# EAGLE design mLRS-tx-dualSx-top-v031 (EAGLE 7.5.0)
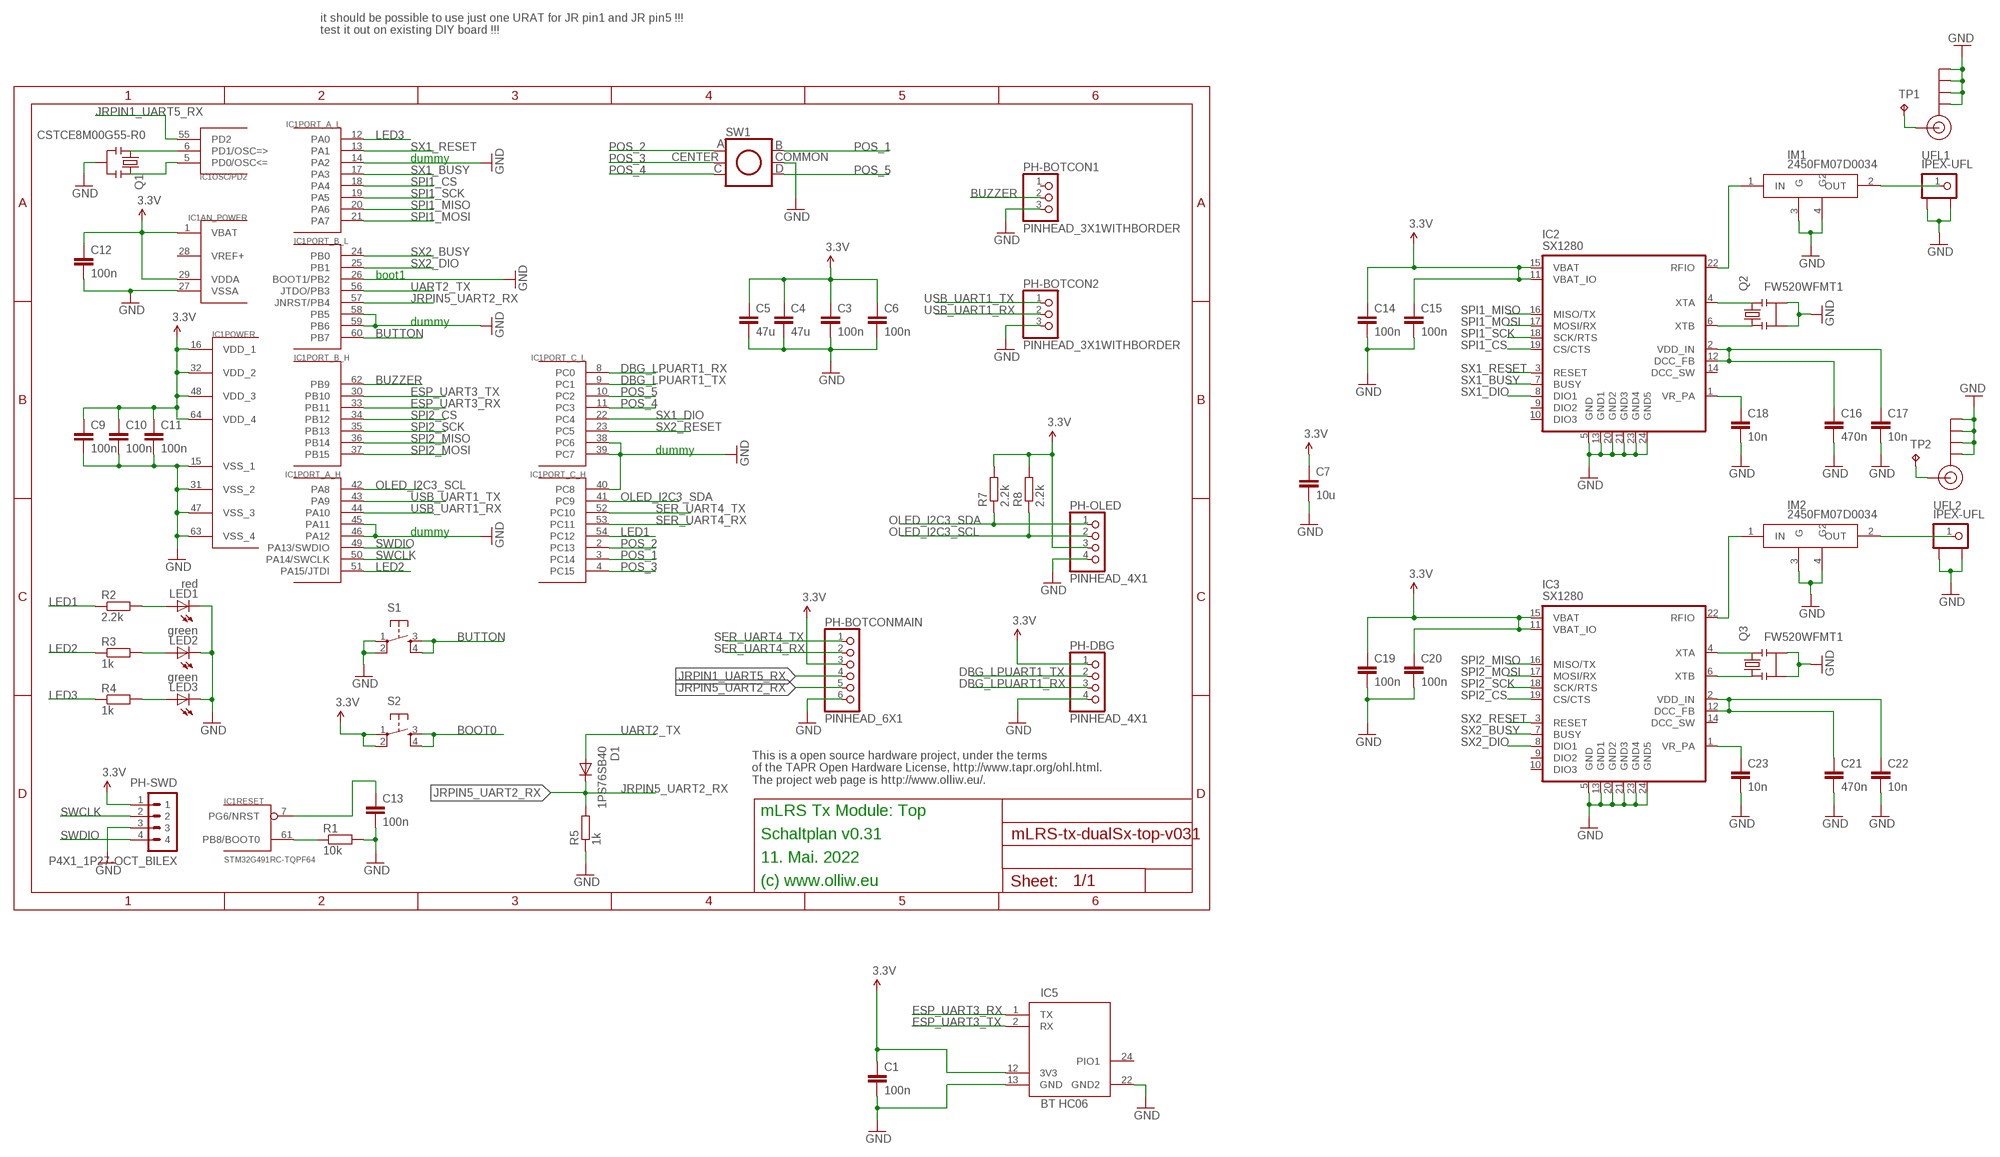
[diagram p0: schematic, sheet 1]

## Parts
C1  100n  C-EUC0603  [C0603]
C3  100n  C-EUC0402  [C0402]
C4  47u  C-EUC1210  [C1210]
C5  47u  C-EUC1206K  [C1206K]
C6  100n  C-EUC0402  [C0402]
C7  10u  C-EUC0603  [C0603]
C9  100n  C-EUC0402  [C0402]
C10  100n  C-EUC0402  [C0402]
C11  100n  C-EUC0402  [C0402]
C12  100n  C-EUC0402  [C0402]
C13  100n  C-EUC0402  [C0402]
C14  100n  C-EUC0402  [C0402]
C15  100n  C-EUC0402  [C0402]
C16  470n  C-EUC0402  [C0402]
C17  10n  C-EUC0402  [C0402]
C18  10n  C-EUC0402  [C0402]
C19  100n  C-EUC0402  [C0402]
C20  100n  C-EUC0402  [C0402]
C21  470n  C-EUC0402  [C0402]
C22  10n  C-EUC0402  [C0402]
C23  10n  C-EUC0402  [C0402]
D1  1PS76SB40  DIODE-SOD110-R  [SOD110-R]
IC1  STM32G491RC-TQPF64  STM32G4X1RX-TQPF64  [TQFP64]
IC2  SX1280  [QFN24-4X4-SX128X]
IC3  SX1280  [QFN24-4X4-SX128X]
IC5  BT HC06  HC06-BASIC  [BT_HC05_BASIC]
IM1  2450FM07D0034  SX-IMPEDANCE-MATCH  [SX-IMPEDANCE-MATCH]
IM2  2450FM07D0034  SX-IMPEDANCE-MATCH  [SX-IMPEDANCE-MATCH]
LED1  red  LEDCHIPLED_0603  [CHIPLED_0603]
LED2  green  LEDCHIPLED_0603  [CHIPLED_0603]
LED3  green  LEDCHIPLED_0603  [CHIPLED_0603]
PH-BOTCON1  PINHEAD_3X1WITHBORDER  [PINHEAD_3X1]
PH-BOTCON2  PINHEAD_3X1WITHBORDER  [PINHEAD_3X1]
PH-BOTCONMAIN  PINHEAD_6X1  [PINHEAD_6X1]
PH-DBG  PINHEAD_4X1  [PINHEAD_4X1]
PH-OLED  PINHEAD_4X1  [PINHEAD_4X1]
PH-SWD  P4X1_1P27-OCT_BILEX  [4X1_1P27_OCT_BILEX]
Q1  CSTCE8M00G55-R0  RESONATORSMD  [RESONATOR-SMD]
Q2  FW520WFMT1  CRYSTAL52MHZ  [CRYSTAL-SMD-2X1P6-GND]
Q3  FW520WFMT1  CRYSTAL52MHZ  [CRYSTAL-SMD-2X1P6-GND]
R1  10k  R-EU_R0402  [R0402]
R2  2.2k  R-EU_R0402  [R0402]
R3  1k  R-EU_R0402  [R0402]
R4  1k  R-EU_R0402  [R0402]
R5  1k  R-EU_R0402  [R0402]
R7  2.2k  R-EU_R0402  [R0402]
R8  2.2k  R-EU_R0402  [R0402]
RF1  SMA_EDGE  [SMA-EDGE]
RF2  SMA_EDGE  [SMA-EDGE]
S1  TAC_SWITCHPTH  [TACTILE-PTH]
S2  TAC_SWITCHPTH  [TACTILE-PTH]
SW1  JOYSTICK-5WAY  [JOYSTICK-5WAY]
TP1  TPTP10SQ  [TP10SQ]
TP2  TPTP10SQ  [TP10SQ]
UFL1  IPEX-UFL  [IPEX-UFL-SMD]
UFL2  IPEX-UFL  [IPEX-UFL-SMD]

## Nets
3.3V: C1.1 C3.1 C4.1 C5.1 C6.1 C7.1 C9.1 C10.1 C11.1 C12.1 C14.1 C15.1 C19.1 C20.1 IC1.1(AN_POWER:VBAT) IC1.16(POWER:VDD_1) IC1.29(AN_POWER:VDDA) IC1.32(POWER:VDD_2) IC1.48(POWER:VDD_3) IC1.64(POWER:VDD_4) IC2.11(VBAT_IO) IC2.15(VBAT) IC3.11(VBAT_IO) IC3.15(VBAT) IC5.12(3V3) PH-BOTCONMAIN.3 PH-DBG.1 PH-OLED.3 PH-SWD.1 R7.2 R8.2 S2.1 S2.2
BOOT0: IC1.61(RESET:PB8/BOOT0) R1.1 S2.3 S2.4
BUTTON: IC1.60(PORT_B_L:PB7) S1.3 S1.4
BUZZER: IC1.62(PORT_B_H:PB9) PH-BOTCON1.2
DBG_LPUART1_RX: IC1.8(PORT_C_L:PC0) PH-DBG.3
DBG_LPUART1_TX: IC1.9(PORT_C_L:PC1) PH-DBG.2
ESP_UART3_RX: IC1.33(PORT_B_H:PB11) IC5.1(TX)
ESP_UART3_TX: IC1.30(PORT_B_H:PB10) IC5.2(RX)
GND: C1.2 C3.2 C4.2 C5.2 C6.2 C7.2 C9.2 C10.2 C11.2 C12.2 C13.2 C14.2 C15.2 C16.2 C17.2 C18.2 C19.2 C20.2 C21.2 C22.2 C23.2 IC1.14(PORT_A_L:PA2) IC1.15(POWER:VSS_1) IC1.26(PORT_B_L:BOOT1/PB2) IC1.27(AN_POWER:VSSA) IC1.31(POWER:VSS_2) IC1.38(PORT_C_L:PC6) IC1.39(PORT_C_L:PC7) IC1.40(PORT_C_H:PC8) IC1.45(PORT_A_H:PA11) IC1.46(PORT_A_H:PA12) IC1.47(POWER:VSS_3) IC1.58(PORT_B_L:PB5) IC1.59(PORT_B_L:PB6) IC1.63(POWER:VSS_4) IC2.5(GND) IC2.13(GND1) IC2.20(GND2) IC2.21(GND3) IC2.23(GND4) IC2.24(GND5) IC3.5(GND) IC3.13(GND1) IC3.20(GND2) IC3.21(GND3) IC3.23(GND4) IC3.24(GND5) IC5.13(GND) IC5.22(GND2) IM1.3(G) IM1.4(G2) IM2.3(G) IM2.4(G2) LED1.C LED2.C LED3.C PH-BOTCON1.3 PH-BOTCON2.3 PH-BOTCONMAIN.6 PH-DBG.4 PH-OLED.4 PH-SWD.3 Q1.2 Q2.2 Q2.4 Q3.2 Q3.4 R1.2 R5.1 RF1.GND@0(GND) RF1.GND@1(GND) RF1.GND@2(GND) RF1.GND@3(GND) RF2.GND@0(GND) RF2.GND@1(GND) RF2.GND@2(GND) RF2.GND@3(GND) S1.1 S1.2 SW1.5(COMMON) UFL1.2 UFL1.3 UFL2.2 UFL2.3
JRPIN1_UART5_RX: IC1.55(OSC/PD2:PD2) PH-BOTCONMAIN.4
JRPIN5_UART2_RX: D1.C IC1.57(PORT_B_L:JNRST/PB4) PH-BOTCONMAIN.5 R5.2
LED1: IC1.54(PORT_C_H:PC12) R2.1
LED2: IC1.51(PORT_A_H:PA15/JTDI) R3.1
LED3: IC1.12(PORT_A_L:PA0) R4.1
N$1: RF2.SIG(SIGNAL) TP1.TP
N$2: C21.1 C22.1 IC3.2(VDD_IN) IC3.12(DCC_FB)
N$3: RF1.SIG(SIGNAL) TP2.TP
N$4: LED1.A R2.2
N$5: C13.1 IC1.7(RESET:PG6/NRST)
N$6: C23.1 IC3.1(VR_PA)
N$7: IC3.4(XTA) Q3.3
N$8: LED2.A R3.2
N$9: LED3.A R4.2
N$10: IC3.6(XTB) Q3.1
N$11: IC3.22(RFIO) IM2.1(IN)
N$12: IC1.5(OSC/PD2:PD0/OSC<=) Q1.3
N$13: C16.1 C17.1 IC2.2(VDD_IN) IC2.12(DCC_FB)
N$14: IC1.6(OSC/PD2:PD1/OSC=>) Q1.1
N$15: C18.1 IC2.1(VR_PA)
N$16: IC2.4(XTA) Q2.3
N$17: IC2.6(XTB) Q2.1
N$18: IC2.22(RFIO) IM1.1(IN)
N$19: IM1.2(OUT) UFL1.1
N$20: IM2.2(OUT) UFL2.1
OLED_I2C3_SCL: IC1.42(PORT_A_H:PA8) PH-OLED.2 R8.1
OLED_I2C3_SDA: IC1.41(PORT_C_H:PC9) PH-OLED.1 R7.1
POS_1: IC1.3(PORT_C_H:PC14) SW1.4(B)
POS_2: IC1.2(PORT_C_H:PC13) SW1.1(A)
POS_3: IC1.4(PORT_C_H:PC15) SW1.2(CENTER)
POS_4: IC1.11(PORT_C_L:PC3) SW1.3(C)
POS_5: IC1.10(PORT_C_L:PC2) SW1.6(D)
SER_UART4_RX: IC1.53(PORT_C_H:PC11) PH-BOTCONMAIN.2
SER_UART4_TX: IC1.52(PORT_C_H:PC10) PH-BOTCONMAIN.1
SPI1_CS: IC1.18(PORT_A_L:PA4) IC2.19(CS/CTS)
SPI1_MISO: IC1.20(PORT_A_L:PA6) IC2.16(MISO/TX)
SPI1_MOSI: IC1.21(PORT_A_L:PA7) IC2.17(MOSI/RX)
SPI1_SCK: IC1.19(PORT_A_L:PA5) IC2.18(SCK/RTS)
SPI2_CS: IC1.34(PORT_B_H:PB12) IC3.19(CS/CTS)
SPI2_MISO: IC1.36(PORT_B_H:PB14) IC3.16(MISO/TX)
SPI2_MOSI: IC1.37(PORT_B_H:PB15) IC3.17(MOSI/RX)
SPI2_SCK: IC1.35(PORT_B_H:PB13) IC3.18(SCK/RTS)
SWCLK: IC1.50(PORT_A_H:PA14/SWCLK) PH-SWD.2
SWDIO: IC1.49(PORT_A_H:PA13/SWDIO) PH-SWD.4
SX1_BUSY: IC1.17(PORT_A_L:PA3) IC2.7(BUSY)
SX1_DIO: IC1.22(PORT_C_L:PC4) IC2.8(DIO1)
SX1_RESET: IC1.13(PORT_A_L:PA1) IC2.3(RESET)
SX2_BUSY: IC1.24(PORT_B_L:PB0) IC3.7(BUSY)
SX2_DIO: IC1.25(PORT_B_L:PB1) IC3.8(DIO1)
SX2_RESET: IC1.23(PORT_C_L:PC5) IC3.3(RESET)
UART2_TX: D1.A IC1.56(PORT_B_L:JTDO/PB3)
USB_UART1_RX: IC1.44(PORT_A_H:PA10) PH-BOTCON2.2
USB_UART1_TX: IC1.43(PORT_A_H:PA9) PH-BOTCON2.1
Unconnected: IC1.28(AN_POWER:VREF+) IC2.9(DIO2) IC2.10(DIO3) IC2.14(DCC_SW) IC3.9(DIO2) IC3.10(DIO3) IC3.14(DCC_SW) IC5.24(PIO1) PH-BOTCON1.1

## Notes on the sheet
- it should be possible to use just one URAT for JR pin1 and JR pin5 !!!
  test it out on existing DIY board !!!
- dummy
- boot1
- dummy
- dummy
- dummy
- This is a open source hardware project, under the terms
  of the TAPR Open Hardware License, http://www.tapr.org/ohl.html.
  The project web page is http://www.olliw.eu/.
- mLRS Tx Module: Top
- Schaltplan v0.31
- 11. Mai. 2022
- (c) www.olliw.eu

## Library data of the parts
C1 C3-C7 C9-C23 = rcl:C-EU: CAPACITOR, European symbol
D1 = diode:DIODE-: DIODE
IC1 = # stm32:STM32G4X1RX
IC2 IC3 = # stdlib:SX1280
IC5 = # SerialPortBluetooth:HC06-BASIC
IM1 IM2 = # stdlib:SX-IMPEDANCE-MATCH
LED1-LED3 = led:LED: LED OSRAM: - CHIPLED LG R971, LG N971, LY N971, LG Q971, LY Q971, LO R971, LY R971 LH N974, LH R974 LS Q976, LO Q976, LY Q976 LO Q996 - Hyper CHIPLED LW Q18S LB Q993, LB Q99A, LB R99A - SideLED LS A670, LO A670, LY A670, LG A670, LP A670 LB A673, LV A673, LT A673, LW A673 LH A674 LY A675 LS A676, LA A676, LO A676, LY A676, LW A676 LS A679, LY A679, LG A679 - Hyper Micro SIDELED® LS Y876, LA Y876, LO Y876, LY Y876 LT Y87S - SmartLED LW L88C, LW L88S LB L89C, LB L89S, LG L890 LS L89K, LO L89K, LY L89K LS L896, LA L896, LO L896, LY L896 - TOPLED LS T670, LO T670, LY T670, LG T670, LP T670 LSG T670, LSP T670, LSY T670, LOP T670, LYG T670 LG T671, LOG T671, LSG T671 LB T673, LV T673, LT T673, LW T673 LH T674 LS T676, LA T676, LO T676, LY T676, LB T676, LH T676, LSB T676, LW T676 LB T67C, LV T67C, LT T67C, LS T67K, LO T67K, LY T67K, LW E67C LS E67B, LA E67B, LO E67B, LY E67B, LB E67C, LV E67C, LT E67C LW T67C LS T679, LY T679, LG T679 LS T770, LO T770, LY T770, LG T770, LP T770 LB T773, LV T773, LT T773, LW T773 LH T774 LS E675, LA E675, LY E675, LS T675 LS T776, LA T776, LO T776, LY T776, LB T776 LHGB T686 LT T68C, LB T68C - Hyper Mini TOPLED® LB M676 - Mini TOPLED Santana® LG M470 LS M47K, LO M47K, LY M47K Source: http://www.osram.convergy.de LUXEON: - LUMILED® LXK2-PW12-R00, LXK2-PW12-S00, LXK2-PW14-U00, LXK2-PW14-V00 LXK2-PM12-R00, LXK2-PM12-S00, LXK2-PM14-U00 LXK2-PE12-Q00, LXK2-PE12-R00, LXK2-PE12-S00, LXK2-PE14-T00, LXK2-PE14-U00 LXK2-PB12-K00, LXK2-PB12-L00, LXK2-PB12-M00, LXK2-PB14-N00, LXK2-PB14-P00, LXK2-PB14-Q00 LXK2-PR12-L00, LXK2-PR12-M00, LXK2-PR14-Q00, LXK2-PR14-R00 LXK2-PD12-Q00, LXK2-PD12-R00, LXK2-PD12-S00 LXK2-PH12-R00, LXK2-PH12-S00 LXK2-PL12-P00, LXK2-PL12-Q00, LXK2-PL12-R00 Source: www.luxeon.com KINGBRIGHT: KA-3528ASYC Source: www.kingbright.com
PH-BOTCON1 PH-BOTCON2 = # stdlib:PINHEAD_3X1
PH-BOTCONMAIN = # stdlib:PINHEAD_6X1
PH-DBG PH-OLED = # stdlib:PINHEAD_4X1
PH-SWD = # stdlib:P4X1_1P27
Q1 = # SparkFun2:RESONATOR: Resonator Small SMD resonator. This is the itty bitty 10/20MHz resonators with built in caps. CSTCE10M0G55 and CSTCE20M0V53. Footprint has been reviewed closely but hasn't been tested yet.
Q2 Q3 = # stdlib:CRYSTAL52MHZ
R1-R5 R7 R8 = rcl:R-EU_: RESISTOR, European symbol
RF1 RF2 = # SparkFun2:SMA_EDGE: SMA Antenna Connector End launch SMA connector. The paste layer has been removed so that the connector can be hand soldered onto the board after reflow.
S1 S2 = # SparkFun2:TAC_SWITCH: Momentary Switch Button commonly used for reset or general input. Spark Fun Electronics SKU : COM-00097
SW1 = # stdlib:JOYSTICK-5WAY
TP1 TP2 = testpad:TP: Test pad
UFL1 UFL2 = # stdlib:IPEX-UFL

## Board
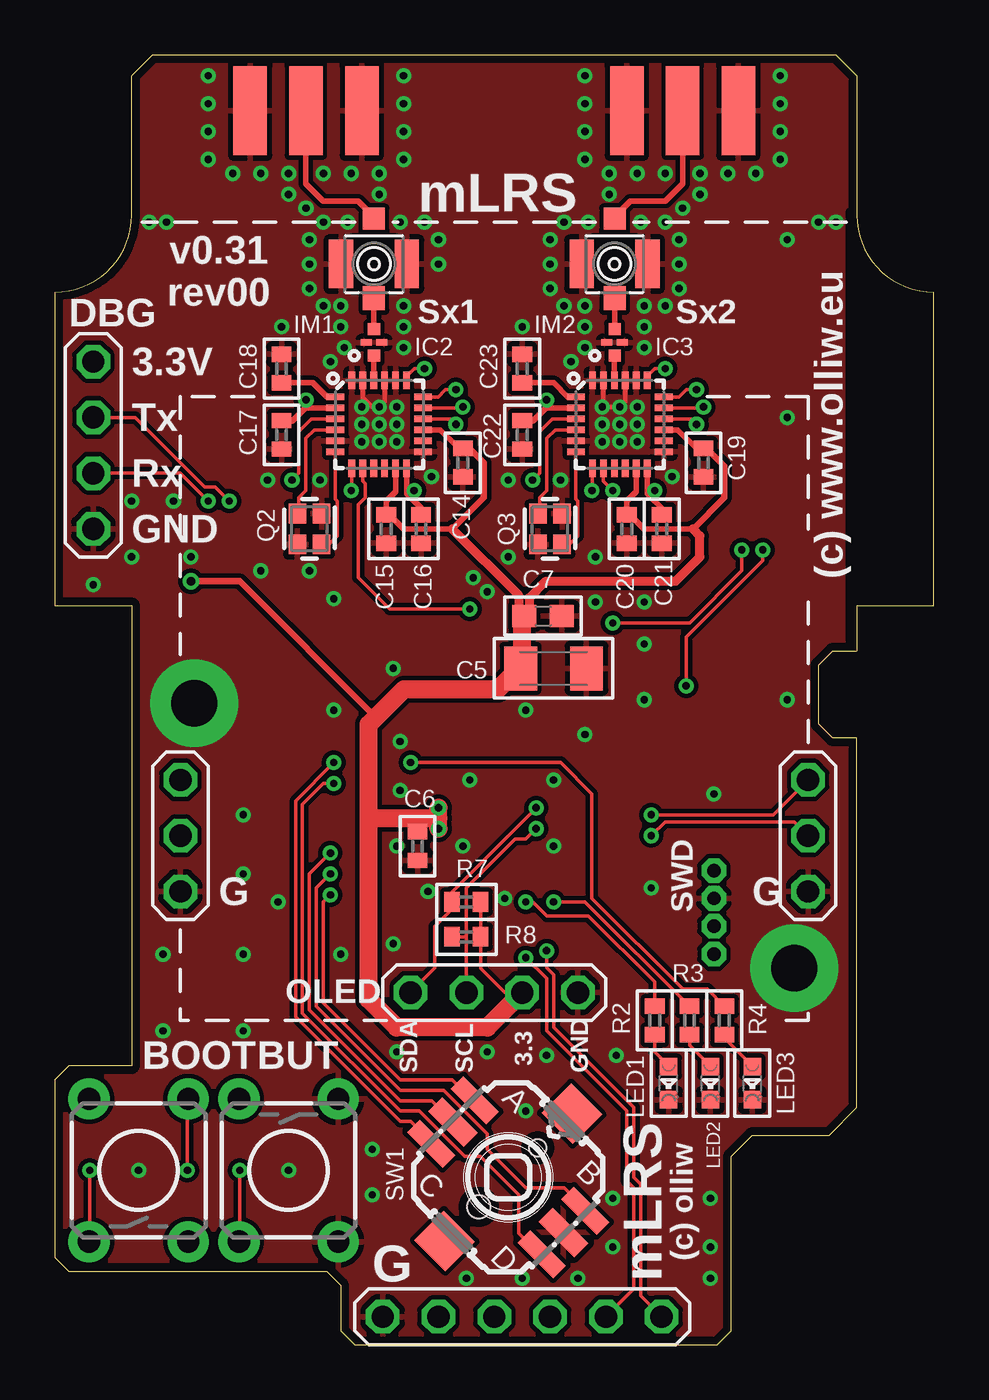
[diagram p1: board, top side]
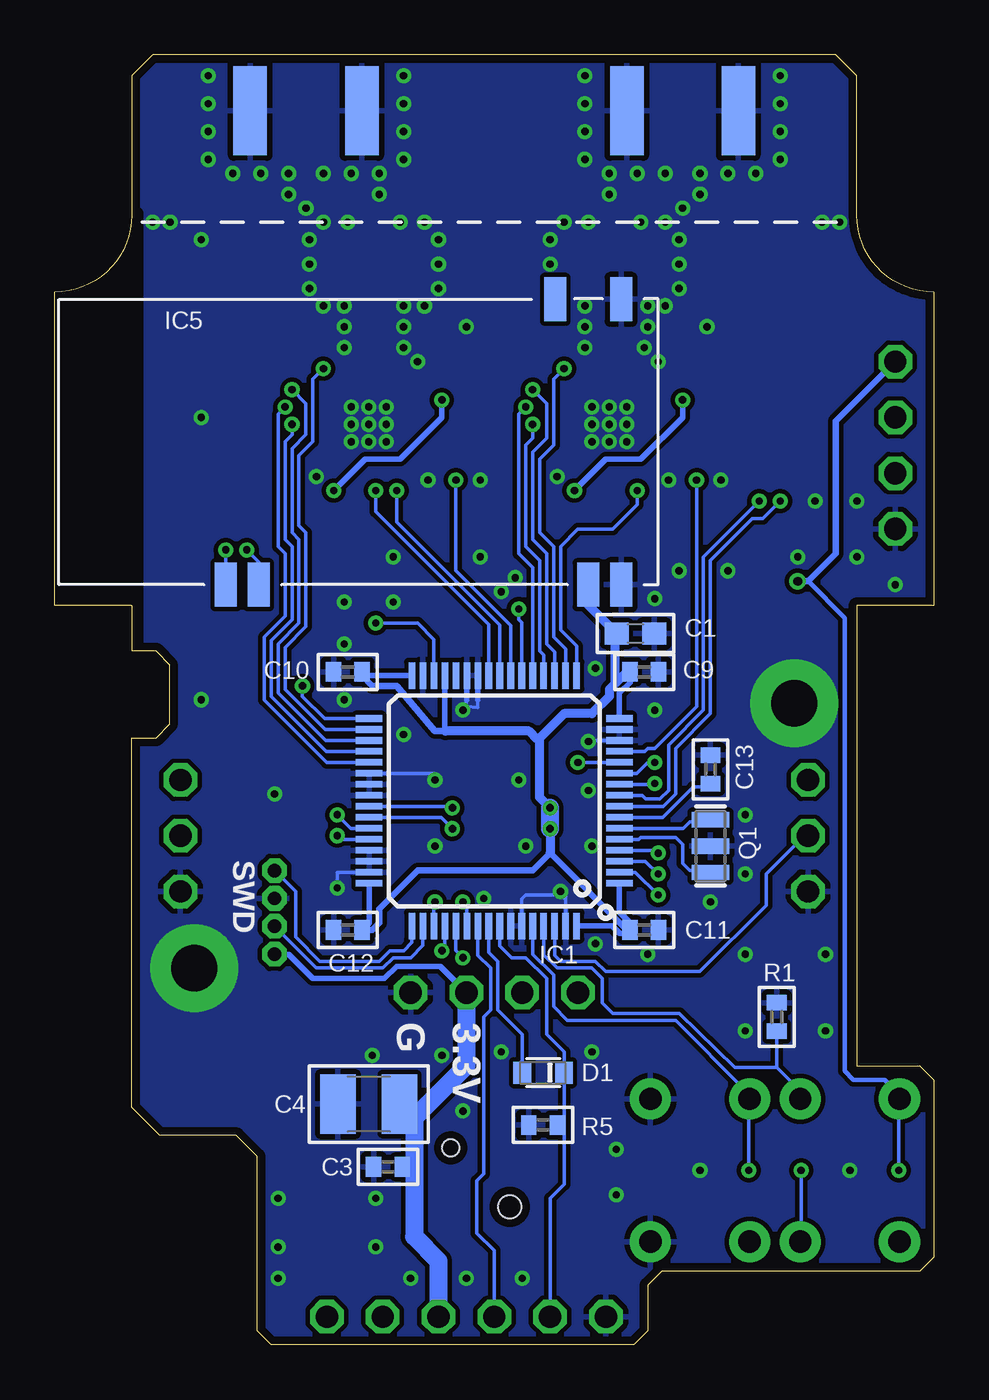
[diagram p2: board, bottom side, seen from below]

Size 40.01 x 58.74 mm. Coordinates in mm from the lower left corner, seen from the top.
Outline: 36.51,10.79 36.51,27.62 35.4,27.62 34.77,28.26 34.77,30.96 35.4,31.59 36.51,31.59 36.51,33.66 40.01,33.66 40.01,47.94 arc-90 36.51,51.44 36.51,57.78 35.56,58.74 4.45,58.74 3.49,57.78 3.49,51.44 arc-90 0,47.94 0,33.66 3.49,33.66 3.49,12.7 0.64,12.7 0,12.07 0,3.97 0.64,3.33 12.38,3.33 13.02,2.7 13.02,0.63 13.65,0 30.16,0 30.8,0.63 30.8,8.57 31.75,9.53 35.24,9.53 36.51,10.79
Copper layers (1*16): Top 0.0356mm / dielectric 1.5011mm / Bottom 0.0356mm
Design rules "ow-oshpark-2layer": minimum track width 6mil, minimum drill 13mil, track to track 6mil, track to pad 6mil, pad to pad 6mil, via to via 6mil, smd to smd 6mil, copper to edge 15mil, drill to drill 6mil, minimum pad ring 7mil, minimum via ring 7mil, stop-mask expansion 2.5mil, vias tented up to drill 26mil, thermal gap 10mil
tRestrict: area 36.2,31.1 to 40.2,51.6
bRestrict: area 36.2,31.1 to 40.2,51.6

### Footprints (pad centres in the part's own frame; a part is rotated, then mirrored left to right if it is on the bottom)
C0603 = smd 1.1 x 1: 1 -0.85,0; 2 0.85,0
C0402 = smd 0.7 x 0.9: 1 -0.65,0; 2 0.65,0
C1210 = smd 1.6 x 2.7: 1 -1.4,0; 2 1.4,0
C1206K = smd 1.5 x 2: 1 -1.5,0; 2 1.5,0
SOD110-R = smd 0.8 x 1: A 0.95,0; C -0.95,0
TQFP64 = smd 1.2 x 0.3: 1 -5.7,3.75; 2 -5.7,3.25; 3 -5.7,2.75; 4 -5.7,2.25; 5 -5.7,1.75; 6 -5.7,1.25; 7 -5.7,0.75; 8 -5.7,0.25; 9 -5.7,-0.25; 10 -5.7,-0.75; 11 -5.7,-1.25; 12 -5.7,-1.75; 13 -5.7,-2.25; 14 -5.7,-2.75; 15 -5.7,-3.25; 16 -5.7,-3.75; 33 5.7,-3.75; 34 5.7,-3.25; 35 5.7,-2.75; 36 5.7,-2.25; 37 5.7,-1.75; 38 5.7,-1.25; 39 5.7,-0.75; 40 5.7,-0.25; 41 5.7,0.25; 42 5.7,0.75; 43 5.7,1.25; 44 5.7,1.75; 45 5.7,2.25; 46 5.7,2.75; 47 5.7,3.25; 48 5.7,3.75 | smd 0.3 x 1.2: 17 -3.75,-5.7; 18 -3.25,-5.7; 19 -2.75,-5.7; 20 -2.25,-5.7; 21 -1.75,-5.7; 22 -1.25,-5.7; 23 -0.75,-5.7; 24 -0.25,-5.7; 25 0.25,-5.7; 26 0.75,-5.7; 27 1.25,-5.7; 28 1.75,-5.7; 29 2.25,-5.7; 30 2.75,-5.7; 31 3.25,-5.7; 32 3.75,-5.7; 49 3.75,5.7; 50 3.25,5.7; 51 2.75,5.7; 52 2.25,5.7; 53 1.75,5.7; 54 1.25,5.7; 55 0.75,5.7; 56 0.25,5.7; 57 -0.25,5.7; 58 -0.75,5.7; 59 -1.25,5.7; 60 -1.75,5.7; 61 -2.25,5.7; 62 -2.75,5.7; 63 -3.25,5.7; 64 -3.75,5.7
QFN24-4X4-SX128X = smd 0.8 x 0.3: 1 -2,1.25; 2 -2,0.75; 3 -2,0.25; 4 -2,-0.25; 5 -2,-0.75; 6 -2,-1.25; 13 2,-1.25; 14 2,-0.75; 15 2,-0.25; 16 2,0.25; 17 2,0.75; 18 2,1.25 | smd 0.3 x 0.8: 7 -1.25,-2; 8 -0.75,-2; 9 -0.25,-2; 10 0.25,-2; 11 0.75,-2; 12 1.25,-2; 19 1.25,2; 20 0.75,2; 21 0.25,2; 22 -0.25,2; 23 -0.75,2; 24 -1.25,2
BT_HC05_BASIC = smd 2 x 1: 1 0,0; 2 0,-1.5; 12 0,-16.5; 13 0,-18; 22 13,-18; 24 13,-15
SX-IMPEDANCE-MATCH = smd 0.55 x 0.55: 1 -0.6,0; 2 0.6,0 | smd 0.3 x 0.5: 3 0,-0.35; 4 0,0.35
CHIPLED_0603 = smd 0.8 x 0.8: A 0,-0.75; C 0,0.75
PINHEAD_3X1 = drill 1.016 octagon: 1 0,0; 2 0,-2.54; 3 0,-5.08
PINHEAD_6X1 = drill 1.016 octagon: 1 0,12.7; 2 0,10.16; 3 0,7.62; 4 0,5.08; 5 0,2.54; 6 0,0
PINHEAD_4X1 = drill 1.016 octagon: 1 0,7.62; 2 0,5.08; 3 0,2.54; 4 0,0
4X1_1P27_OCT_BILEX = drill 0.61 pad 1.118 octagon: 1 0,0; 2 0,-1.27; 3 0,-2.54; 4 0,-3.81
RESONATOR-SMD = smd 0.7 x 1.7: 1 -1.2,0; 2 0,0; 3 1.2,0
CRYSTAL-SMD-2X1P6-GND = smd 0.9 x 0.8: 1 -0.7,-0.55; 2 0.7,-0.55; 3 0.7,0.55; 4 -0.7,0.55
R0402 = smd 0.7 x 0.9: 1 -0.65,0; 2 0.65,0
SMA-EDGE = smd 1.524 x 4.064: GND@0 0,0; GND@1 5.08,0; SIG 2.54,0 | smd 1.524 x 4.064 bottom: GND@2 0,0; GND@3 5.08,0
TACTILE-PTH = drill 1.016 pad 1.88: 1 -3.251,2.261; 2 3.251,2.261; 3 -3.251,-2.261; 4 3.251,-2.261
JOYSTICK-5WAY = smd 2.286 x 0.813: 1 -3.556,1.4; 3 -3.556,-1.4; 4 3.556,1.4; 6 3.556,-1.4 | smd 2.286 x 0.914: 2 -3.556,0; 5 3.556,0 | smd 2 x 1.9: S 0,4.1; T 0,-4.1 | hole 0.75: 0,1.9 | hole 1.05: 0,-1.9
TP10SQ = smd 1 x 1: TP 0,0
IPEX-UFL-SMD = smd 1 x 1.1: 1 0,-1.55 | smd 1.1 x 2.2: 2 -1.5,0; 3 1.5,0

### Placement (x,y rotation side)
C1  13.57,32.38 0 bottom
C3  24.84,8.1 180 bottom
C4  25.72,10.95 180 bottom
C5  22.7,30.8 0 top
C6  16.51,22.7 270 top
C7  22.22,33.18 0 top
C9  13.18,30.64 0 bottom
C10  26.67,30.64 180 bottom
C11  13.18,18.89 0 bottom
C12  26.67,18.89 180 bottom
C13  10.16,26.19 90 bottom
C14  18.57,40.16 270 top
C15  15.08,37.15 270 top
C16  16.67,37.15 270 top
C17  10.32,41.43 270 top
C18  10.32,44.45 90 top
C19  29.53,40.16 270 top
C20  26.04,37.15 270 top
C21  27.62,37.15 270 top
C22  21.27,41.43 270 top
C23  21.27,44.45 90 top
D1  17.78,12.38 180 bottom
IC1  20,24.77 180 bottom
IC2  14.76,41.91 0 top
IC3  25.72,41.91 0 top
IC5  32.23,34.61 90 bottom
IM1  14.53,45.64 90 top
IM2  25.48,45.64 90 top
LED1  27.94,11.91 180 top
LED2  29.84,11.91 180 top
LED3  31.75,11.91 180 top
PH-BOTCON1  5.71,25.72 0 top
PH-BOTCON2  34.29,25.72 0 top
PH-BOTCONMAIN  14.92,1.27 270 top
PH-DBG  1.75,37.15 0 top
PH-OLED  23.81,16.03 90 top
PH-SWD  30,17.78 180 top
Q1  10.16,22.7 270 bottom
Q2  11.59,37.15 90 top
Q3  22.54,37.15 90 top
R1  7.14,14.92 90 bottom
R2  27.3,14.76 270 top
R3  28.89,14.76 270 top
R4  30.48,14.76 270 top
R5  17.78,10 0 bottom
R7  18.73,20.16 0 top
R8  18.73,18.57 0 top
RF1  26.04,56.2 0 top
RF2  8.89,56.2 0 top
S1  10.64,7.94 270 top
S2  3.81,7.94 90 top
SW1  20.64,7.62 315 top
TP1  14.53,51.28 0 top
TP2  25.48,51.28 0 top
UFL1  14.53,49.21 0 top
UFL2  25.48,49.21 0 top

### Tracks (layer width: path | path; a pad name or v marks a point on that pad's centre or on a via)
3.3V  (via drill 0.33, 0.4)
  Top 0.152: PH-OLED.3 20.48,16.03 19.38,17.13 R8.2 R7.2 | v1.59,7.94 1.59,4.72 S2.1 | C6.1 16.51,23.97
  Top 0.254: IC3.11 26.47,38.85 26.04,38.42 C20.1 26.18,37.8 26.83,37.15 29.05,37.15 | IC2.11 15.51,38.85 15.08,38.42 C15.1 15.22,37.8 15.88,37.15 18.1,37.15 | IC2.15 17.55,41.66 18.26,40.96 18.43,40.96 C14.1 | IC3.15 28.35,41.66 29.21,40.8 29.38,40.8 C19.1
  Top 0.305: 29.05,37.15 30.48,38.58 30.48,40.02 29.69,40.81 C19.1 | 14.61,28.57 8.41,34.77 v6.19,34.77 | C14.1 18.88,40.81 19.53,40.16 19.53,38.58 18.1,37.15
  Top 0.406: C7.1 21.11,33.28 21.11,34.13 18.1,37.15 | C7.1 21.59,33.23 21.59,34.01 22.35,34.77 28.26,34.77 29.37,35.88 29.37,36.83 29.05,37.15 | 21.27,30.96 21.36,30.8 C5.1 | C7.1 21.27,33.18
  Top 0.813: PH-OLED.3 19.68,14.45 15.56,14.45 14.29,15.72 14.29,23.97 | 14.29,23.97 14.29,28.26 14.3,28.26 14.61,28.57 15.89,29.84 20.16,29.84 21.27,30.96 21.27,33.18 | 17.46,23.97 v17.46,24.45 | v17.46,23.5 17.46,23.97 | 17.46,23.97 16.51,23.97 14.29,23.97
  Bottom 0.152: S2.2 1.55,11.15 1.59,11.11 | 1.59,11.11 v1.59,7.94 | 1.59,11.11 1.59,11.43
  Bottom 0.203: 1.59,11.43 2.22,12.07 3.65,12.07 4.05,12.46 4.05,33.1 5.71,34.77
  Bottom 0.254: IC1.1 14.3,19.7 13.81,19.21 13.81,18.88 C11.1 13.97,18.73 14.29,18.73 14.62,19.07 IC1.64 | IC1.48 25.7,19.21 C12.1 | PH-SWD.1 29.37,17.78 28.26,16.67 25,16.67 24.45,17.22 22.46,17.22 PH-OLED.3 | IC1.32 26,30.46 C10.1 | IC1.29 22.25,27.97 22.22,27.94 | 13.81,30.64 13.83,30.65 C9.1 13.81,30.78 13.81,30.16 14.3,29.67 IC1.16
  Bottom 0.305: C9.1 13.97,30.64 | C10.1 26.02,30.46 25.56,30 24.45,30 22.7,27.94 22.22,27.94 | C12.1 25.56,18.89 25.24,19.21 25.24,19.84 23.49,21.59 18.26,21.59 17.46,22.38 13.81,18.73 C11.1 | PH-DBG.1 4.45,42.07 4.45,36.04 5.71,34.77 v6.19,34.77
  Bottom 0.406: 13.97,30.64 14.53,30.08 | 14.53,30.08 14.76,29.84 14.76,29.53 15.56,28.73 16.83,28.73 18.02,27.54 | v17.46,23.5 17.46,22.38 | v17.46,24.45 17.94,24.92 17.94,27.46 18.02,27.54 | 18.02,27.54 18.41,27.94 22.22,27.94 | 14.53,30.08 14.53,32.23 14.42,32.33 C1.1 15.73,33.69 IC5.12
  Bottom 0.61: C4.1 23.97,10.95 23.65,10.32 | C3.1 23.65,8.25
  Bottom 0.813: PH-OLED.3 21.27,12.7 23.65,10.32 23.65,8.25 23.65,4.92 22.54,3.81 PH-BOTCONMAIN.3 | v17.46,23.5 v17.46,24.45
BOOT0  (via drill 0.33)
  Top 0.152: S2.4 6.07,11.15 6.03,11.11 v6.03,7.94
  Bottom 0.152: IC1.61 17.75,17.75 17.14,17.14 15.56,17.14 15.08,16.67 15.08,15.56 14.61,15.08 11.59,15.08 9.05,12.62 7.14,12.62 | v6.03,7.94 6.03,4.72 S2.3 | 7.14,12.62 R1.1 | S2.4 6.07,11.55 7.14,12.62
BUTTON  (via drill 0.33)
  Top 0.152: v8.41,7.94 8.41,4.72 S1.4
  Bottom 0.152: IC1.60 18.25,17.78 17.3,16.83 17.3,15.4 16.67,14.76 11.75,14.76 8.57,11.59 8.57,11.39 S1.3 8.38,11.15 8.41,11.11 v8.41,7.94
BUZZER
  Bottom 0.152: IC1.62 17.25,17.73 16.99,17.46 15.4,17.46 14.92,16.99 10.64,16.99 7.62,20 7.62,21.43 5.87,23.18 PH-BOTCON1.2
DBG_LPUART1_RX  (via drill 0.33)
  Top 0.152: PH-DBG.3 5.71,39.69 v6.99,38.42
  Bottom 0.152: IC1.8 12.31,24.52 11.75,25.08 11.75,27.15 10.16,28.73 10.16,35.72 8.26,37.62 7.78,37.62 v6.99,38.42
DBG_LPUART1_TX  (via drill 0.33)
  Top 0.152: v7.94,38.42 7.3,39.05 6.83,39.05 3.65,42.23 PH-DBG.2
  Bottom 0.152: v7.94,38.42 10.48,35.88 10.48,28.89 12.06,27.3 12.06,25.24 12.46,24.84 13.1,24.84 13.27,25.02 IC1.9
ESP_UART3_RX  (via drill 0.33)
  Top 0.152: v28.73,30 28.73,32.23 32.23,35.72 v32.23,36.2
  Bottom 0.152: IC1.33 27.72,28.52 28.73,29.53 v28.73,30 | IC5.1 v32.23,36.2
ESP_UART3_TX  (via drill 0.33)
  Top 0.152: v25.4,32.86 28.89,32.86 31.27,35.24 v31.27,36.2
  Bottom 0.152: IC1.30 22.75,32.12 23.49,32.86 v25.4,32.86 | IC5.2 30.73,35.65 v31.27,36.2
GND  (via drill 0.33, 2.1 pad 4)
  Top 0.203: IC2.23 14.01,43.14 14.45,42.7 | IC2.21 15.01,42.95 v14.76,42.7 | IC3.23 24.97,42.75 v24.92,42.7 v25.72,42.7 25.97,42.95 IC3.21
  Bottom 0.152: v16.99,20.64 16.75,20.4 16.75,20 | IC1.26 20.75,29.01 21.27,29.05 21.27,29.23 21.26,30.8 | IC1.63 16.75,20.25 16.99,20.48 18.57,20.48 18.75,20.3 IC1.59 | IC1.47 27.15,21.52 v27.15,20.8 | IC1.38 22.7,26.02 v22.7,25.72 | IC1.14 15.72,27.52 v15.72,27.46
  Bottom 0.254: 20.75,30.8 20.75,29.37 | 21.26,30.8 21.26,29.37
  other vias: 33.66,17.14 6.35,29.21 6.99,57.78 6.99,56.52 6.99,55.24 6.99,53.98 8.1,53.34 9.37,53.34 13.49,53.34 14.76,53.34 15.88,53.98 15.88,57.78 15.88,56.52 15.88,55.24 10.64,53.34 12.22,53.34 24.13,57.78 24.13,56.52 24.13,55.24 24.13,53.98 25.24,53.34 26.51,53.34 27.78,53.34 29.37,53.34 30.64,53.34 31.91,53.34 33.02,57.78 33.02,56.52 33.02,55.24 33.02,53.98 1.75,34.61 24.13,27.78 18.89,25.72 18.57,22.7 15.56,22.7 15.4,30.8 12.7,28.89 8.57,24.13 8.57,21.43 15.4,18.26 13.02,17.78 26.83,29.37 22.38,13.18 15.56,13.34 19.68,13.34 25.56,13.18 8.57,14.29 10.16,20.16 21.43,28.89 15.72,25.24 22.7,22.7 30,25.08 10.64,7.94 3.81,7.94 29.84,3.02 29.84,4.45 29.84,6.67 14.45,6.83 23.81,3.02 25.4,4.45 25.4,6.67 26.83,31.91 20.48,20.32 12.7,33.97 33.34,29.37 21.27,3.02 18.73,3.02 8.57,17.78 21.43,10.64 14.45,8.89 4.92,17.78 4.92,14.29 14.76,41.91 13.97,41.91 15.56,41.91 15.56,41.12 14.76,41.12 13.97,41.12 13.97,42.7 15.56,42.7 25.72,41.91 24.92,41.91 26.51,42.7 26.51,41.91 26.51,41.12 25.72,41.12 24.92,41.12 23.02,39.37 12.06,39.37 13.34,51.12 15.72,51.12 16.83,51.12 17.46,49.21 17.46,50.32 15.88,47.31 15.88,46.35 15.88,45.4 12.22,47.31 11.59,48.1 11.59,49.21 11.59,50.32 12.22,51.12 13.02,47.31 13.18,45.4 12.54,44.77 24.29,51.12 26.67,51.12 27.78,51.12 28.42,49.21 28.42,50.32 28.42,48.1 27.78,47.31 26.83,47.31 26.83,46.35 26.83,45.4 24.13,47.31 23.18,47.31 22.54,48.1 22.54,49.21 22.54,50.32 23.18,51.12 24.13,46.35 24.13,45.4 23.49,44.77 3.49,38.42 5.4,38.42 13.02,46.35 10.64,52.39 11.43,51.75 28.57,51.75 29.37,52.39 25.24,52.39 14.76,52.39 11.59,35.24 19.05,34.92 24.61,35.88 20.64,35.88 9.68,39.37 20.64,39.37 10.32,46.35 21.27,46.35 17.14,39.53 28.1,39.53 24.61,33.81 26.83,33.81 9.37,35.24 19.68,34.29 6.19,35.88 3.49,35.88 33.34,42.23 33.34,50.32 35.56,51.12 4.29,51.12 5.08,51.12 34.77,51.12
  pour Bottom (isolate 0.203, rank 6): -0.64,59.05 40.64,59.05 40.64,-0.32 -0.64,-0.32
  pour Top (isolate 0.203, rank 6): -0.64,59.05 40.64,59.05 40.64,-0.32 -0.64,-0.32
JRPIN1_UART5_RX
  Bottom 0.152: IC1.55 20.75,17.74 20.16,17.14 20.16,15.24 20.48,14.92 20.48,7.78 20.8,7.46 20.8,5.08 20,4.29 PH-BOTCONMAIN.4
JRPIN5_UART2_RX
  Bottom 0.152: IC1.57 19.75,18.16 19.21,17.62 18.57,17.62 17.62,16.67 17.62,14.13 16.83,13.34 16.83,12.23 | 16.83,12.23 D1.C | 16.83,12.23 16.83,9.68 | 16.83,9.68 16.83,7.3 17.46,6.67 PH-BOTCONMAIN.5 | R5.2 16.83,9.68
LED1  (via drill 0.33)
  Top 0.152: R2.1 27.3,16.51 24.29,19.53 22.38,19.53 21.75,20.16 v21.43,20.16
  Bottom 0.152: IC1.54 21.25,19.98 v21.43,20.16
LED2  (via drill 0.33)
  Top 0.152: R3.1 28.75,15.4 28.89,15.4 24.13,20.16 v22.7,20.16
  Bottom 0.152: v22.7,20.16 22.75,20.05 IC1.51
LED3  (via drill 0.33)
  Top 0.152: v16.19,26.51 23.02,26.51 24.45,25.08 24.45,20.32 28.57,16.19 29.7,16.19 R4.1
  Bottom 0.152: IC1.12 15.71,26.52 v16.19,26.51
N$1
  Top 0.254: RF2.SIG 11.43,52.86 12.22,52.07 13.81,52.07 14.61,51.28 14.61,51.04 TP1.TP
N$2  (via drill 0.33)
  Top 0.254: 27.07,38.66 26.97,38.76 IC3.12 | 27.07,38.66 27.62,38.1 C21.1 | IC3.2 22.34,42.66 | 22.34,42.66 21.75,42.07 21.29,42.07 C22.1 | v22.38,43.02 22.38,42.7 22.34,42.66 | v27.3,38.89 27.07,38.66
  Bottom 0.254: v27.3,38.89 25.88,40.32 24.29,40.32 22.38,42.23 v22.38,43.02
N$3
  Top 0.254: RF1.SIG 28.57,52.86 27.78,52.07 26.19,52.07 25.4,51.28 25.4,51.04 TP2.TP
N$4
  Top 0.152: R2.2 27.3,13.34 27.94,12.7 LED1.A
N$5
  Bottom 0.152: IC1.7 12.34,24.02 10.95,25.4 10.3,25.4 C13.1
N$6
  Top 0.254: IC3.1 23.36,43.16 22.7,43.81 21.29,43.81 C23.1
N$7
  Top 0.152: IC3.4 22.77,41.66 22.38,41.27 22.38,38.89 22.07,38.58 22.07,37.92 Q3.3
N$8
  Top 0.152: R3.2 28.91,13.64 29.84,12.7 LED2.A
N$9
  Top 0.152: LED3.A 31.75,12.7 30.48,13.97 R4.2
N$10
  Top 0.152: IC3.6 23.72,38.51 23.81,38.42 23.81,36.83 23.49,36.51 23.16,36.51 Q3.1
N$11
  Top 0.203: 25.47,44.95 IM2.1
  Top 0.254: IC3.22 25.47,44.95
N$12
  Bottom 0.152: IC1.5 13.42,23.02 13.34,23.1 11.74,23.09 11.43,22.78 11.43,21.91 11.11,21.59 10.25,21.59 Q1.3
N$13  (via drill 0.33)
  Top 0.254: 16.19,38.58 16.67,38.1 C16.1 | IC2.12 16.01,38.76 16.19,38.58 | 16.19,38.58 16.35,38.73 v16.35,38.89 | IC2.2 11.39,42.66 | 11.39,42.66 10.79,42.07 10.33,42.07 C17.1 | v11.43,43.02 11.43,42.7 11.39,42.66
  Bottom 0.254: v16.35,38.89 14.92,40.32 13.34,40.32 11.43,42.23 v11.43,43.02
N$14
  Bottom 0.152: IC1.6 11.41,23.52 11.11,23.81 10.25,23.81 Q1.1
N$15
  Top 0.254: IC2.1 12.4,43.16 11.75,43.81 10.33,43.81 C18.1
N$16
  Top 0.152: IC2.4 11.81,41.66 11.43,41.27 11.43,38.89 11.11,38.58 11.11,37.92 Q2.3
N$17
  Top 0.152: IC2.6 12.76,38.51 12.86,38.42 12.86,36.83 12.54,36.51 12.2,36.51 Q2.1
N$18
  Top 0.203: 14.51,44.95 IM1.1
  Top 0.254: IC2.22 14.51,44.95
N$19
  Top 0.254: IM1.2 UFL1.1
N$20
  Top 0.254: IM2.2 UFL2.1
OLED_I2C3_SCL  (via drill 0.33)
  Top 0.152: 18.73,18.57 18.73,20.8 20.95,23.02 21.43,23.02 v21.91,23.5 | 18.73,18.57 PH-OLED.2 | R8.1 18.73,18.57
  Bottom 0.152: IC1.42 22.43,24.02 v21.91,23.5
OLED_I2C3_SDA  (via drill 0.33)
  Top 0.152: v21.91,24.45 18.08,20.62 R7.1 17.94,19.68 17.3,19.05 17.3,17.14 PH-OLED.1
  Bottom 0.152: IC1.41 21.97,24.52 v21.91,24.45
POS_1  (via drill 0.33)
  Top 0.152: SW1.4 24.14,6.18 23.18,7.14 21.43,7.14 19.68,8.89 19.68,9.6 17.7,11.59 15.72,11.59 11.91,15.4 11.91,20.8 v12.54,21.43
  Bottom 0.152: IC1.3 13.12,22.02 v12.54,21.43
POS_2  (via drill 0.33)
  Top 0.152: SW1.1 19.04,11.12 18.1,12.07 15.72,12.07 12.22,15.56 12.22,20.16 v12.54,20.48
  Bottom 0.152: IC1.2 13.58,21.52 v12.54,20.48
POS_3  (via drill 0.33)
  Top 0.152: SW1.2 | SW1.2 17.14,11.11 15.72,11.11 11.59,15.24 11.59,21.43 v12.54,22.38
  Bottom 0.152: IC1.4 12.67,22.52 v12.54,22.38
POS_4  (via drill 0.33)
  Top 0.152: v12.7,26.51 10.95,24.77 10.95,14.92 15.72,10.16 16.19,10.16 16.83,9.53 16.83,9.45 SW1.3
  Bottom 0.152: IC1.11 13.51,26.02 13.02,26.51 v12.7,26.51
POS_5  (via drill 0.33)
  Top 0.152: SW1.6 21.92,4.27 21.11,5.08 21.11,6.83 19.37,8.57 18.65,8.57 16.59,10.64 15.72,10.64 11.27,15.08 11.27,24.61 12.22,25.56 v12.7,25.56
  Bottom 0.152: IC1.10 12.74,25.52 v12.7,25.56
SER_UART4_RX  (via drill 0.33)
  Top 0.152: PH-BOTCONMAIN.2 26.35,2.54 26.35,7.14 26.04,7.46 26.04,10.64 22.38,14.29 22.38,16.67 v21.43,17.62
  Bottom 0.152: IC1.53 21.75,17.94 v21.43,17.62
SER_UART4_TX  (via drill 0.33)
  Top 0.152: PH-BOTCONMAIN.1 26.67,2.22 26.67,7.3 26.35,7.62 26.35,10.79 22.7,14.45 22.7,16.83 22.38,17.14 v22.38,17.94
  Bottom 0.152: IC1.52 22.25,18.07 v22.38,17.94
SPI1_CS  (via drill 0.33)
  Top 0.152: IC2.19 16.01,44.11 16.35,44.45 v16.83,44.45
  Bottom 0.152: IC1.18 16.75,31.67 17.3,32.23 17.3,36.35 17.94,36.99 17.94,40.32 17.3,40.96 17.3,43.97 v16.83,44.45
SPI1_MISO  (via drill 0.33)
  Top 0.152: IC2.16 18.01,42.16 v18.26,41.91
  Bottom 0.152: IC1.20 17.75,31.41 17.94,31.59 17.94,35.72 18.57,36.35 18.57,40.96 18.26,41.27 v18.26,41.91
SPI1_MOSI  (via drill 0.33)
  Top 0.152: IC2.17 18.53,42.66 v18.57,42.7
  Bottom 0.152: IC1.21 18.25,35.4 18.89,36.04 18.89,42.39 v18.57,42.7
SPI1_SCK  (via drill 0.33)
  Top 0.152: IC2.18 17.44,43.16 17.78,43.5 v18.26,43.5
  Bottom 0.152: IC1.19 17.25,31.54 17.62,31.91 17.62,36.04 18.26,36.67 18.26,40.64 17.62,41.27 17.62,42.86 v18.26,43.5
SPI2_CS  (via drill 0.33)
  Top 0.152: IC3.19 26.97,44.11 27.3,44.45 v27.78,44.45
  Bottom 0.152: IC1.34 27.7,28.02 29.53,29.84 29.53,31.75 28.57,32.7 28.57,36.99 28.89,37.31 28.89,40.48 28.26,41.12 28.26,43.97 v27.78,44.45
SPI2_MISO  (via drill 0.33)
  Top 0.152: IC3.16 28.96,42.16 v29.21,41.91
  Bottom 0.152: IC1.36 27.65,27.02 30.16,29.53 30.16,32.07 29.21,33.02 29.21,36.35 29.53,36.67 29.53,41.12 29.21,41.43 v29.21,41.91
SPI2_MOSI  (via drill 0.33)
  Top 0.152: IC3.17 29.48,42.66 v29.53,42.7
  Bottom 0.152: IC1.37 27.63,26.52 30.48,29.37 30.48,32.23 29.53,33.18 29.53,36.04 29.84,36.35 29.84,42.39 v29.53,42.7
SPI2_SCK  (via drill 0.33)
  Top 0.152: IC3.18 28.4,43.16 28.73,43.5 v29.21,43.5
  Bottom 0.152: IC1.35 27.67,27.52 29.84,29.69 29.84,31.91 28.89,32.86 28.89,36.67 29.21,36.99 29.21,40.8 28.57,41.43 28.57,42.86 v29.21,43.5
SWCLK
  Bottom 0.152: IC1.50 23.25,18.18 23.81,17.62 24.61,17.62 25.08,17.14 28.1,17.14 PH-SWD.2
SWDIO
  Bottom 0.152: IC1.49 23.75,18.32 24.13,17.94 24.76,17.94 25.24,17.46 27.94,17.46 29.05,18.57 29.05,20.64 PH-SWD.4
SX1_BUSY  (via drill 0.33)
  Top 0.152: IC2.7 13.51,38.91 v13.49,38.89
  Bottom 0.152: IC1.17 16.25,31.81 16.99,32.54 16.99,36.35 16.19,37.15 14.61,37.15 13.49,38.26 v13.49,38.89
SX1_DIO  (via drill 0.33)
  Top 0.152: v18.89,33.5 15.24,33.5 13.81,34.92 13.81,38.26 14.13,38.58 14.13,39.21 14.01,39.33 IC2.8
  Bottom 0.152: IC1.22 18.75,32.88 18.89,33.02 v18.89,33.5
SX1_RESET  (via drill 0.33)
  Top 0.152: IC2.3 11.68,42.16 11.11,41.59 11.11,39.69 v10.79,39.37
  Bottom 0.152: IC1.13 13.15,27.02 13.02,27.15 12.7,27.15 10.79,29.05 v10.79,39.37
SX2_BUSY  (via drill 0.33)
  Top 0.152: IC3.7 24.47,38.91 v24.45,38.89
  Bottom 0.152: IC1.24 19.75,32.77 24.45,37.46 v24.45,38.89
SX2_DIO  (via drill 0.33)
  Top 0.152: IC3.8 24.97,39.33 v25.4,38.89
  Bottom 0.152: IC1.25 20.25,32.79 25.4,37.94 v25.4,38.89
SX2_RESET  (via drill 0.33)
  Top 0.152: IC3.3 22.63,42.16 22.07,41.59 22.07,39.69 v21.75,39.37
  Bottom 0.152: IC1.23 19.25,32.75 21.75,35.24 v21.75,39.37
UART2_TX
  Bottom 0.152: IC1.56 20.25,17.87 19.84,17.46 19.84,15.24 18.73,14.13 D1.A
USB_UART1_RX  (via drill 0.33)
  Top 0.152: v27.15,23.18 27.78,23.81 33.66,23.81 PH-BOTCON2.2
  Bottom 0.152: IC1.44 26.98,23.02 v27.15,23.18
USB_UART1_TX  (via drill 0.33)
  Top 0.152: v27.15,24.13 32.7,24.13 PH-BOTCON2.1
  Bottom 0.152: IC1.43 26.53,23.52 v27.15,24.13

### Text on the board
tNames: mLRS | v0.31 / rev00 | DBG | Sx1 | Sx2 | 3.3V | Tx | (c) www.olliw.eu | Rx | GND | G | SWD | G | OLED | BOOT | BUT | SDA | SCL | 3.3 | GND | mLRS | (c) olliw | G
bNames: SWD | 3.3V | G